# Altium schematic sheet Sheet1.SchDoc
size A4
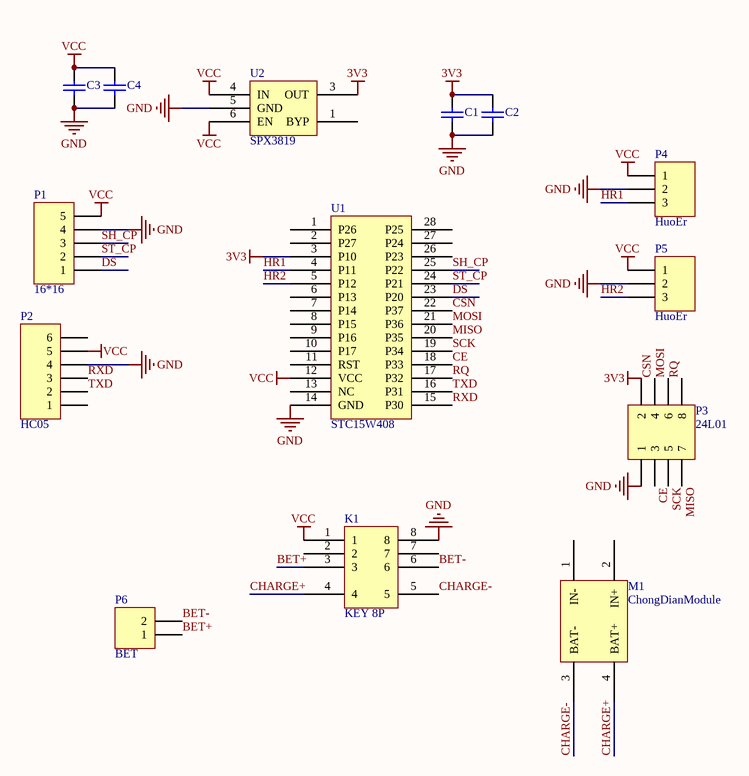
[diagram p0: Sheet1.SchDoc]

## Parts
C1  Cap  [C0805]  (value not drawn)
C2  Cap  [C0805]  (value not drawn)
C3  Cap  [C0805]  (value not drawn)
C4  Cap  [C0805]  (value not drawn)
K1  KEY 8P  [key 8p]
M1  ChongDianModule  [ChongDianModule]
P1  16*16  [HDR1X5]
P2  HC05  [HDR1X6]
P3  24L01  [HDR2X4]
P4  HuoEr  [HDR1X3]
P5  HuoEr  [HDR1X3]
P6  BET  [HDR1X2]
U1  STC15W408  [SOP28]
U2  SPX3819  [SOP5(6)]

## Nets
3V3: C1.2 C2.2 P3.2 U1.3(P10) U2.3(OUT)
GND: C1.1 C2.1 C3.1 C4.1 K1.8 P1.4 P2.4 P3.1 P4.2 P5.2 U1.14(GND) U2.5(GND)
VCC: C3.2 C4.2 K1.1 P1.5 P2.5 P4.1 P5.1 U1.12(VCC) U2.4(IN) U2.6(EN)
BET+: K1.3 P6.1
BET-: K1.6 P6.2
CE: P3.3 U1.18(P33)
CHARGE+: K1.4 M1.4(BAT+)
CHARGE-: K1.5 M1.3(BAT-)
CSN: P3.4 U1.22(P37)
DS: P1.1 U1.23(P20)
HR1: P4.3 U1.4(P11)
HR2: P5.3 U1.5(P12)
MISO: P3.7 U1.20(P35)
MOSI: P3.6 U1.21(P36)
RQ: P3.8 U1.17(P32)
RXD: P2.3 U1.15(P30)
SCK: P3.5 U1.19(P34)
SH_CP: P1.3 U1.25(P22)
ST_CP: P1.2 U1.24(P21)
TXD: P2.2 U1.16(P31)

Not connected (* = marked no-connect by the designer): K1 2 7; M1 1(IN-) 2(IN+); P2 1 6; U1 1(P26) 2(P27) 6(P13) 7(P14) 8(P15) 9(P16) 10(P17) 11(RST) 13(NC) 26(P23) 27(P24) 28(P25); U2 1(BYP)

## Library data of the parts
C1-C4 = Cap: Capacitor; Value: 100pF; Published: 8-Jun-2000; LatestRevisionDate: 17-Jul-2002; LatestRevisionNote: Re-released for DXP Platform.; PackageReference: RAD-0.3; Publisher: Altium Limited; PackageDescription: Radial Cap, Thru-Hole; 2 Leads; 0.3 in Pin Spacing
P1 = Header 5: Header, 5-Pin; LatestRevisionDate: 17-Jul-2002; LatestRevisionNote: Re-released for DXP Platform.; Publisher: Altium Limited
P2 = Header 6: Header, 6-Pin; LatestRevisionDate: 17-Jul-2002; LatestRevisionNote: Re-released for DXP Platform.; Publisher: Altium Limited
P3 = Header 4X2: Header, 4-Pin, Dual row; LatestRevisionDate: 17-Jul-2002; LatestRevisionNote: Re-released for DXP Platform.; Publisher: Altium Limited
P4 P5 = Header 3: Header, 3-Pin; LatestRevisionDate: 17-Jul-2002; LatestRevisionNote: Re-released for DXP Platform.; Publisher: Altium Limited
P6 = Header 2: Header, 2-Pin; LatestRevisionDate: 17-Jul-2002; LatestRevisionNote: Re-released for DXP Platform.; Publisher: Altium Limited